# Altium project LimeSDR-X3_1v2.PrjPcb (part 2 of 20)

## Sheet 08_LMS1_RF.SchDoc: LMS7002M RF (LMS1)
size A3; Organization: Lime Microsystems; Address1: Surrey Tech Centre; Address2: Guildford GU2 7YG; Address3: Surrey; Address4: United Kingdom; Revision: 1.2; SheetNumber: 8; SheetTotal: 31
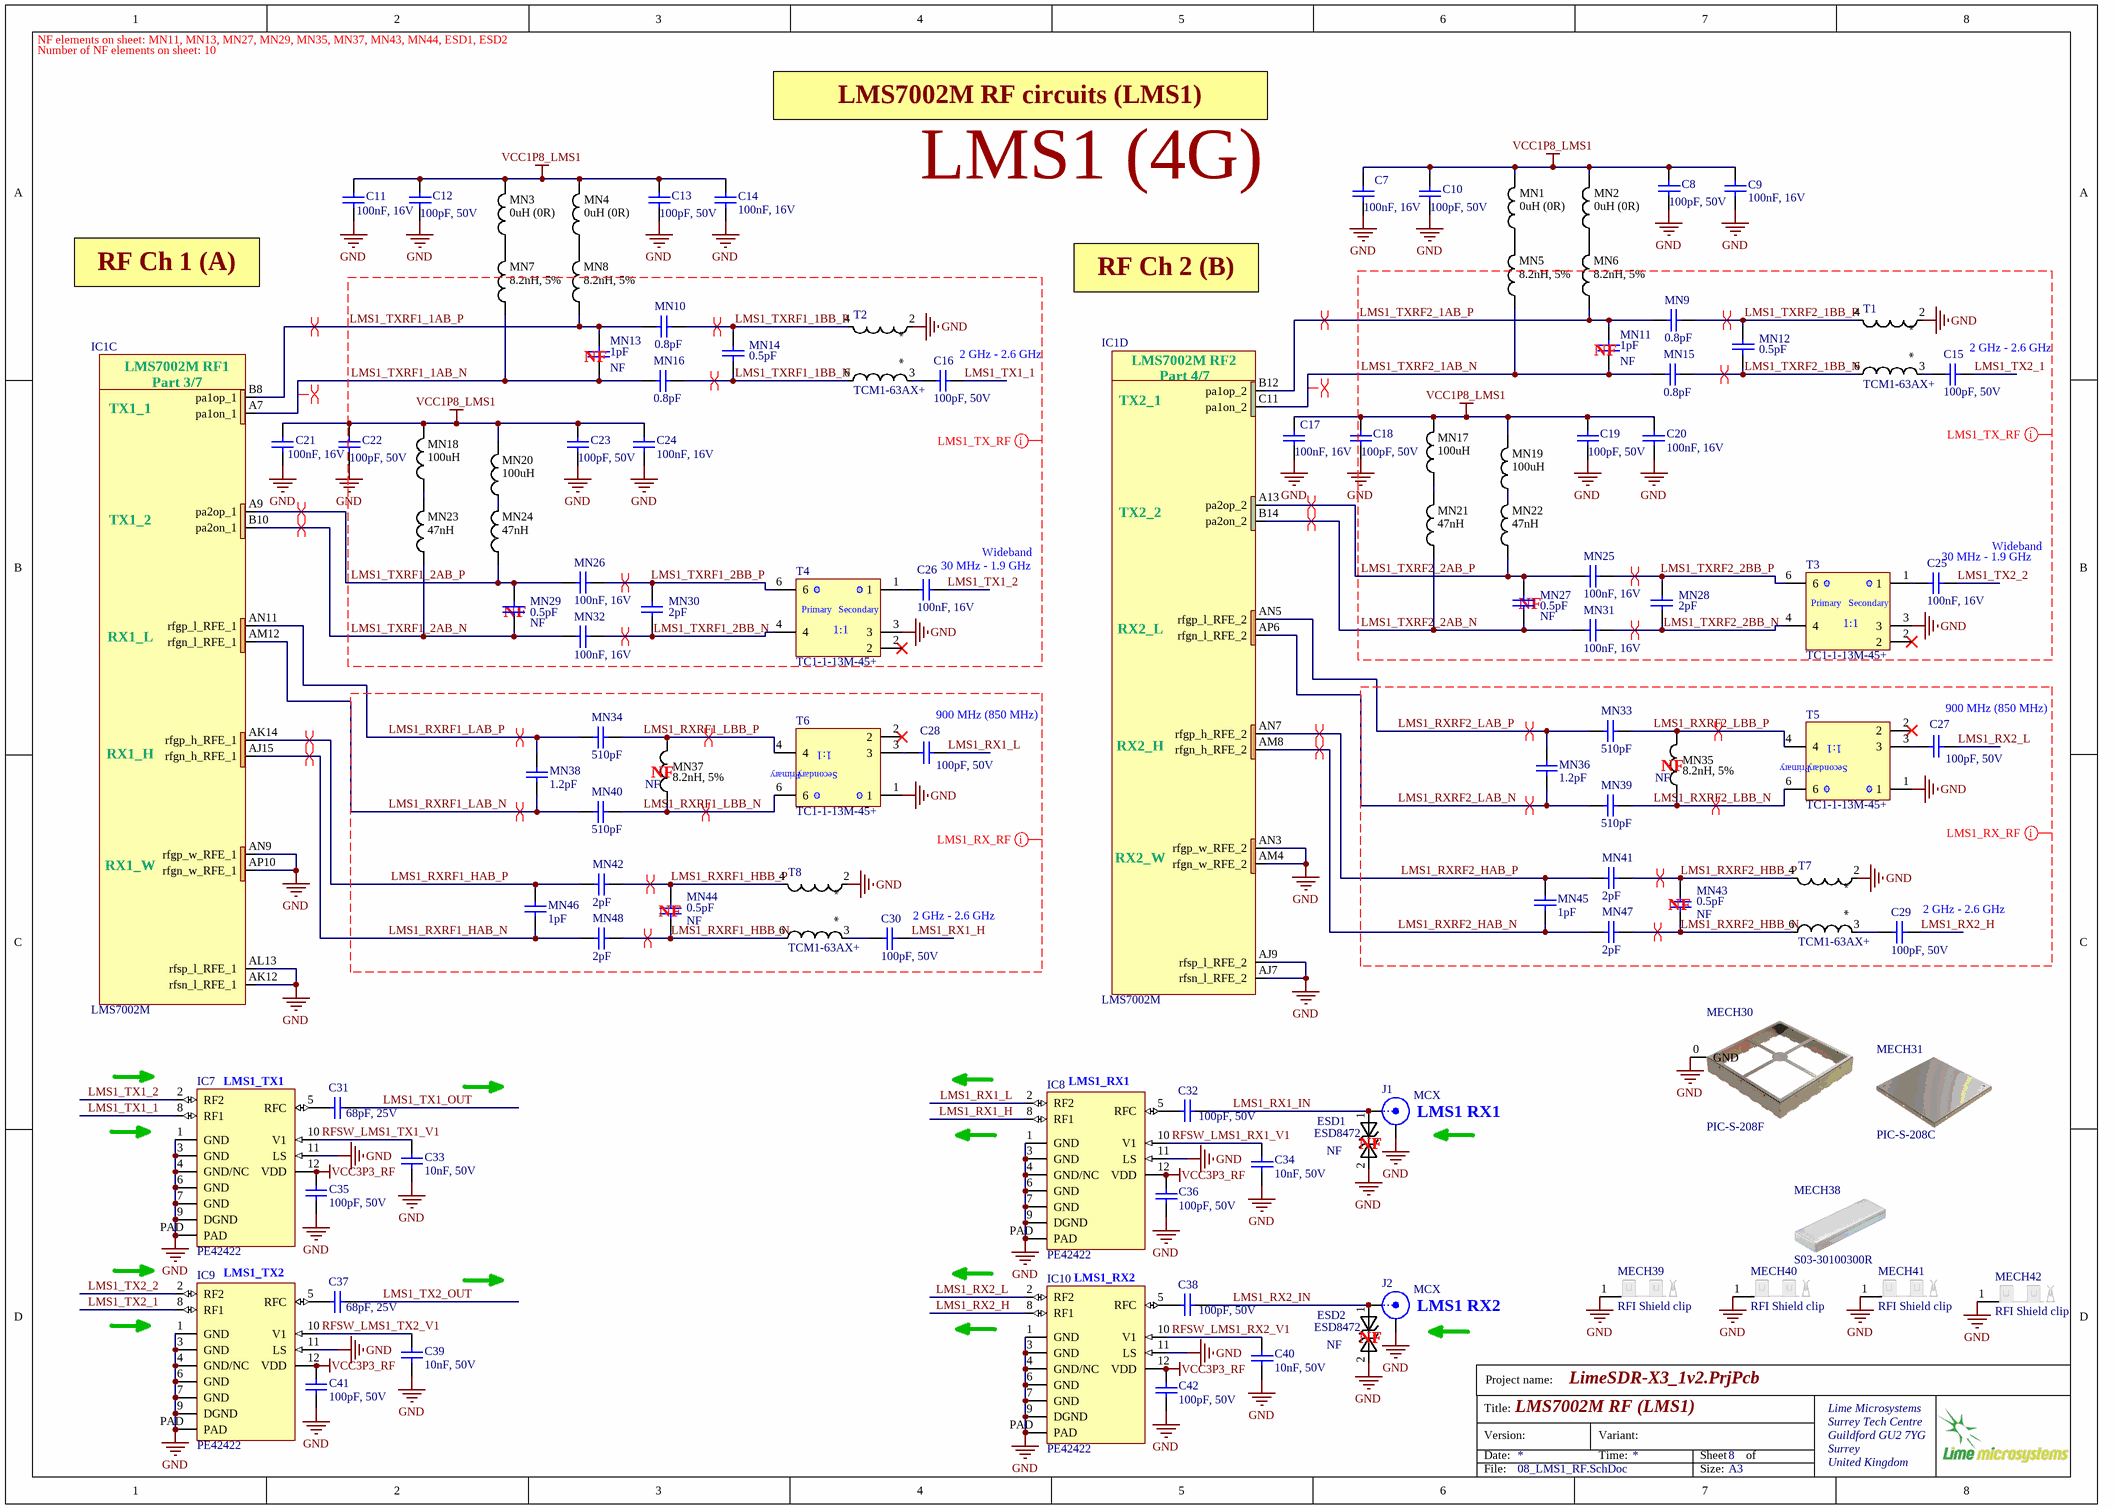
[diagram p7: 08_LMS1_RF.SchDoc]

### Parts
C7  100nF, 16V  [CAP0402]
C8  100pF, 50V  [CAP0402]
C9  100nF, 16V  [CAP0402]
C10  100pF, 50V  [CAP0402]
C11  100nF, 16V  [CAP0402]
C12  100pF, 50V  [CAP0402]
C13  100pF, 50V  [CAP0402]
C14  100nF, 16V  [CAP0402]
C15  100pF, 50V  [CAP0402]
C16  100pF, 50V  [CAP0402]
C17  100nF, 16V  [CAP0402]
C18  100pF, 50V  [CAP0402]
C19  100pF, 50V  [CAP0402]
C20  100nF, 16V  [CAP0402]
C21  100nF, 16V  [CAP0402]
C22  100pF, 50V  [CAP0402]
C23  100pF, 50V  [CAP0402]
C24  100nF, 16V  [CAP0402]
C25  100nF, 16V  [CAP0402]
C26  100nF, 16V  [CAP0402]
C27  100pF, 50V  [CAP0402]
C28  100pF, 50V  [CAP0402]
C29  100pF, 50V  [CAP0402]
C30  100pF, 50V  [CAP0402]
C31  68pF, 25V  [CAP0402]
C32  100pF, 50V  [CAP0402]
C33  10nF, 50V  [CAP0402]
C34  10nF, 50V  [CAP0402]
C35  100pF, 50V  [CAP0402]
C36  100pF, 50V  [CAP0402]
C37  68pF, 25V  [CAP0402]
C38  100pF, 50V  [CAP0402]
C39  10nF, 50V  [CAP0402]
C40  10nF, 50V  [CAP0402]
C41  100pF, 50V  [CAP0402]
C42  100pF, 50V  [CAP0402]
ESD1  ESD8472  Assembly Info: NF  [ESD8472_X3DFN2]
ESD2  ESD8472  Assembly Info: NF  [ESD8472_X3DFN2]
IC1  LMS7002M  [LMS7002M_v5]  (parts C,D of 7)
IC7  PE42422  [PE42422_QFN12]
IC8  PE42422  [PE42422_QFN12]
IC9  PE42422  [PE42422_QFN12]
IC10  PE42422  [PE42422_QFN12]
J1  MCX  [MCX_connector_vertical_SM]
J2  MCX  [MCX_connector_vertical_SM]
MECH30  PIC-S-208F  [PIC-S-208F_RF_SHIELD_FRAME_r0]
MECH31  PIC-S-208C  [PIC-S-208C_RF_SHIELD_COVER]
MECH38  S03-30100300R  [S03-30100300R_RF_SHIELD]
MECH39  RFI Shield clip  [RFI_SHIELD_CLPS_MINI]
MECH40  RFI Shield clip  [RFI_SHIELD_CLPS_MINI]
MECH41  RFI Shield clip  [RFI_SHIELD_CLPS_MINI]
MECH42  RFI Shield clip  [RFI_SHIELD_CLPS_MINI]
MN1  0uH (0R)  [RES0603]
MN2  0uH (0R)  [RES0603]
MN3  0uH (0R)  [RES0603]
MN4  0uH (0R)  [RES0603]
MN5  8.2nH, 5%  [RES0402]
MN6  8.2nH, 5%  [RES0402]
MN7  8.2nH, 5%  [RES0402]
MN8  8.2nH, 5%  [RES0402]
MN9  0.8pF  [CAP0402]
MN10  0.8pF  [CAP0402]
MN11  1pF  Assembly Info: NF  [CAP0402]
MN12  0.5pF  [CAP0402]
MN13  1pF  Assembly Info: NF  [CAP0402]
MN14  0.5pF  [CAP0402]
MN15  0.8pF  [CAP0402]
MN16  0.8pF  [CAP0402]
MN17  100uH  [RES0603]
MN18  100uH  [RES0603]
MN19  100uH  [RES0603]
MN20  100uH  [RES0603]
MN21  47nH  [RES0402]
MN22  47nH  [RES0402]
MN23  47nH  [RES0402]
MN24  47nH  [RES0402]
MN25  100nF, 16V  [CAP0402]
MN26  100nF, 16V  [CAP0402]
MN27  0.5pF  Assembly Info: NF  [CAP0402]
MN28  2pF  [CAP0402]
MN29  0.5pF  Assembly Info: NF  [CAP0402]
MN30  2pF  [CAP0402]
MN31  100nF, 16V  [CAP0402]
MN32  100nF, 16V  [CAP0402]
MN33  510pF  [CAP0402]
MN34  510pF  [CAP0402]
MN35  8.2nH, 5%  Assembly Info: NF  [RES0402]
MN36  1.2pF  [CAP0402]
MN37  8.2nH, 5%  Assembly Info: NF  [RES0402]
MN38  1.2pF  [CAP0402]
MN39  510pF  [CAP0402]
MN40  510pF  [CAP0402]
MN41  2pF  [CAP0402]
MN42  2pF  [CAP0402]
MN43  0.5pF  Assembly Info: NF  [CAP0402]
MN44  0.5pF  Assembly Info: NF  [CAP0402]
MN45  1pF  [CAP0402]
MN46  1pF  [CAP0402]
MN47  2pF  [CAP0402]
MN48  2pF  [CAP0402]
T1  TCM1-63AX+  [TCM1-63AX+_v2]
T2  TCM1-63AX+  [TCM1-63AX+_v2]
T3  TC1-1-13M-45+  [TC1-1-13MA+_JA4220-AL_]
T4  TC1-1-13M-45+  [TC1-1-13MA+_JA4220-AL_]
T5  TC1-1-13M-45+  [TC1-1-13MA+_JA4220-AL_]
T6  TC1-1-13M-45+  [TC1-1-13MA+_JA4220-AL_]
T7  TCM1-63AX+  [TCM1-63AX+_v2]
T8  TCM1-63AX+  [TCM1-63AX+_v2]

### Nets
GND: C7.1 C8.1 C9.1 C10.1 C11.1 C12.1 C13.1 C14.1 C17.1 C18.1 C19.1 C20.1 C21.1 C22.1 C23.1 C24.1 C33.2 C34.2 C35.1 C36.1 C39.2 C40.2 C41.1 C42.1 ESD1.2 ESD2.2 IC1.AJ7(rfsn_l_RFE_2) IC1.AJ9(rfsp_l_RFE_2) IC1.AK12(rfsn_l_RFE_1) IC1.AL13(rfsp_l_RFE_1) IC1.AM4(rfgn_w_RFE_2) IC1.AN3(rfgp_w_RFE_2) IC1.AN9(rfgp_w_RFE_1) IC1.AP10(rfgn_w_RFE_1) IC7.1(GND) IC7.3(GND) IC7.4(GND/NC) IC7.6(GND) IC7.7(GND) IC7.9(DGND) IC7.11(LS) IC7.PAD IC8.1(GND) IC8.3(GND) IC8.4(GND/NC) IC8.6(GND) IC8.7(GND) IC8.9(DGND) IC8.11(LS) IC8.PAD IC9.1(GND) IC9.3(GND) IC9.4(GND/NC) IC9.6(GND) IC9.7(GND) IC9.9(DGND) IC9.11(LS) IC9.PAD IC10.1(GND) IC10.3(GND) IC10.4(GND/NC) IC10.6(GND) IC10.7(GND) IC10.9(DGND) IC10.11(LS) IC10.PAD J1.2(Y) J2.2(Y) MECH30.0(GND) MECH39.1(GND) MECH40.1(GND) MECH41.1(GND) MECH42.1(GND) T1.2 T2.2 T3.3 T4.3 T5.1 T6.1 T7.2 T8.2
VCC1P8_LMS1: C7.2 C8.2 C9.2 C10.2 C11.2 C12.2 C13.2 C14.2 C17.2 C18.2 C19.2 C20.2 C21.2 C22.2 C23.2 C24.2 MN1.2 MN2.2 MN3.2 MN4.2 MN17.2 MN18.2 MN19.2 MN20.2
VCC3P3_RF: C35.2 C36.2 C41.2 C42.2 IC7.12(VDD) IC8.12(VDD) IC9.12(VDD) IC10.12(VDD)
LMS1_RX1_H: C30.1 IC8.8(RF1)
LMS1_RX1_IN: C32.1 ESD1.1 J1.1(X)
LMS1_RX1_L: C28.1 IC8.2(RF2)
LMS1_RX2_H: C29.1 IC10.8(RF1)
LMS1_RX2_IN: C38.1 ESD2.1 J2.1(X)
LMS1_RX2_L: C27.1 IC10.2(RF2)
LMS1_RXRF1_HAB_N: IC1.AJ15(rfgn_h_RFE_1) MN46.1 MN48.2
LMS1_RXRF1_HAB_P: IC1.AK14(rfgp_h_RFE_1) MN42.2 MN46.2
LMS1_RXRF1_HBB_N: MN44.1 MN48.1 T8.6
LMS1_RXRF1_HBB_P: MN42.1 MN44.2 T8.4
LMS1_RXRF1_LAB_N: IC1.AM12(rfgn_l_RFE_1) MN38.1 MN40.2
LMS1_RXRF1_LAB_P: IC1.AN11(rfgp_l_RFE_1) MN34.2 MN38.2
LMS1_RXRF1_LBB_N: MN37.1 MN40.1 T6.6
LMS1_RXRF1_LBB_P: MN34.1 MN37.2 T6.4
LMS1_RXRF2_HAB_N: IC1.AM8(rfgn_h_RFE_2) MN45.1 MN47.2
LMS1_RXRF2_HAB_P: IC1.AN7(rfgp_h_RFE_2) MN41.2 MN45.2
LMS1_RXRF2_HBB_N: MN43.1 MN47.1 T7.6
LMS1_RXRF2_HBB_P: MN41.1 MN43.2 T7.4
LMS1_RXRF2_LAB_N: IC1.AP6(rfgn_l_RFE_2) MN36.1 MN39.2
LMS1_RXRF2_LAB_P: IC1.AN5(rfgp_l_RFE_2) MN33.2 MN36.2
LMS1_RXRF2_LBB_N: MN35.1 MN39.1 T5.6
LMS1_RXRF2_LBB_P: MN33.1 MN35.2 T5.4
LMS1_TX1_1: C16.1 IC7.8(RF1)
LMS1_TX1_2: C26.1 IC7.2(RF2)
LMS1_TX1_OUT: C31.2
LMS1_TX2_1: C15.1 IC9.8(RF1)
LMS1_TX2_2: C25.1 IC9.2(RF2)
LMS1_TX2_OUT: C37.2
LMS1_TXRF1_1AB_N: IC1.A7(pa1on_1) MN7.1 MN13.2 MN16.2
LMS1_TXRF1_1AB_P: IC1.B8(pa1op_1) MN8.1 MN10.2 MN13.1
LMS1_TXRF1_1BB_N: MN14.1 MN16.1 T2.6
LMS1_TXRF1_1BB_P: MN10.1 MN14.2 T2.4
LMS1_TXRF1_2AB_N: IC1.B10(pa2on_1) MN23.1 MN29.1 MN32.1
LMS1_TXRF1_2AB_P: IC1.A9(pa2op_1) MN24.1 MN26.2 MN29.2
LMS1_TXRF1_2BB_N: MN30.1 MN32.2 T4.4
LMS1_TXRF1_2BB_P: MN26.1 MN30.2 T4.6
LMS1_TXRF2_1AB_N: IC1.C11(pa1on_2) MN5.1 MN11.2 MN15.2
LMS1_TXRF2_1AB_P: IC1.B12(pa1op_2) MN6.1 MN9.2 MN11.1
LMS1_TXRF2_1BB_N: MN12.1 MN15.1 T1.6
LMS1_TXRF2_1BB_P: MN9.1 MN12.2 T1.4
LMS1_TXRF2_2AB_N: IC1.B14(pa2on_2) MN21.1 MN27.1 MN31.1
LMS1_TXRF2_2AB_P: IC1.A13(pa2op_2) MN22.1 MN25.2 MN27.2
LMS1_TXRF2_2BB_N: MN28.1 MN31.2 T3.4
LMS1_TXRF2_2BB_P: MN25.1 MN28.2 T3.6
RFSW_LMS1_RX1_V1: C34.1 IC8.10(V1)
RFSW_LMS1_RX2_V1: C40.1 IC10.10(V1)
RFSW_LMS1_TX1_V1: C33.1 IC7.10(V1)
RFSW_LMS1_TX2_V1: C39.1 IC9.10(V1)
NetC15_2: C15.2 T1.3
NetC16_2: C16.2 T2.3
NetC25_2: C25.2 T3.1
NetC26_2: C26.2 T4.1
NetC27_2: C27.2 T5.3
NetC28_2: C28.2 T6.3
NetC29_2: C29.2 T7.3
NetC30_2: C30.2 T8.3
NetC31_1: C31.1 IC7.5(RFC)
NetC32_2: C32.2 IC8.5(RFC)
NetC37_1: C37.1 IC9.5(RFC)
NetC38_2: C38.2 IC10.5(RFC)
NetMN1_1: MN1.1 MN5.2
NetMN2_1: MN2.1 MN6.2
NetMN3_1: MN3.1 MN7.2
NetMN4_1: MN4.1 MN8.2
NetMN17_1: MN17.1 MN21.2
NetMN18_1: MN18.1 MN23.2
NetMN19_1: MN19.1 MN22.2
NetMN20_1: MN20.1 MN24.2

Not connected (* = marked no-connect by the designer): T3 2*; T4 2*; T5 2*; T6 2*

### Layout directives
differential pair: LMS1_RXRF1_HAB_N, LMS1_RXRF1_HAB_P, LMS1_RXRF1_HBB_N, LMS1_RXRF1_HBB_P, LMS1_RXRF1_LAB_N, LMS1_RXRF1_LAB_P, LMS1_RXRF1_LBB_N, LMS1_RXRF1_LBB_P, LMS1_RXRF2_HAB_N, LMS1_RXRF2_HAB_P, LMS1_RXRF2_HBB_N, LMS1_RXRF2_HBB_P, LMS1_RXRF2_LAB_N, LMS1_RXRF2_LAB_P, LMS1_RXRF2_LBB_N, LMS1_RXRF2_LBB_P, LMS1_TXRF1_1AB_N, LMS1_TXRF1_1AB_P, LMS1_TXRF1_1BB_N, LMS1_TXRF1_1BB_P, LMS1_TXRF1_2AB_N, LMS1_TXRF1_2AB_P, LMS1_TXRF1_2BB_N, LMS1_TXRF1_2BB_P, LMS1_TXRF2_1AB_N, LMS1_TXRF2_1AB_P, LMS1_TXRF2_1BB_N, LMS1_TXRF2_1BB_P, LMS1_TXRF2_2AB_N, LMS1_TXRF2_2AB_P, LMS1_TXRF2_2BB_N, LMS1_TXRF2_2BB_P
net class LMS1_TX_RF: GND, LMS1_TX1_1, LMS1_TX1_2, LMS1_TX2_1, LMS1_TX2_2, LMS1_TXRF1_1AB_N, LMS1_TXRF1_1AB_P, LMS1_TXRF1_1BB_N, LMS1_TXRF1_1BB_P, LMS1_TXRF1_2AB_N, LMS1_TXRF1_2AB_P, LMS1_TXRF1_2BB_N, LMS1_TXRF1_2BB_P, LMS1_TXRF2_1AB_N, LMS1_TXRF2_1AB_P, LMS1_TXRF2_1BB_N, LMS1_TXRF2_1BB_P, LMS1_TXRF2_2AB_N, LMS1_TXRF2_2AB_P, LMS1_TXRF2_2BB_N, LMS1_TXRF2_2BB_P, VCC1P8_LMS1
net class LMS1_RX_RF: GND, LMS1_RX1_H, LMS1_RX1_L, LMS1_RX2_H, LMS1_RX2_L, LMS1_RXRF1_HAB_N, LMS1_RXRF1_HAB_P, LMS1_RXRF1_HBB_N, LMS1_RXRF1_HBB_P, LMS1_RXRF1_LAB_N, LMS1_RXRF1_LAB_P, LMS1_RXRF1_LBB_N, LMS1_RXRF1_LBB_P, LMS1_RXRF2_HAB_N, LMS1_RXRF2_HAB_P, LMS1_RXRF2_HBB_N, LMS1_RXRF2_HBB_P, LMS1_RXRF2_LAB_N, LMS1_RXRF2_LAB_P, LMS1_RXRF2_LBB_N, LMS1_RXRF2_LBB_P

### Notes on the sheet
- NF elements on sheet: MN11, MN13, MN27, MN29, MN35, MN37, MN43, MN44, ESD1, ESD2
- Number of NF elements on sheet: 10
- LMS7002M RF circuits (LMS1)
- LMS1 (4G)
- RF Ch 1 (A)
- RF Ch 2 (B)
- (near MN13) NF
- (near C16) 2 GHz - 2.6 GHz
- (near MN11) NF
- (near C15) 2 GHz - 2.6 GHz
- (near C26) 30 MHz - 1.9 GHz
- Wideband
- (near C25) 30 MHz - 1.9 GHz
- (near MN29) NF
- (near MN27) NF
- (near C28) 900 MHz (850 MHz)
- (near C27) 900 MHz (850 MHz)
- (near MN37) NF
- (near MN35) NF
- (near MN44) NF
- (near C30) 2 GHz - 2.6 GHz
- (near MN43) NF
- (near C29) 2 GHz - 2.6 GHz
- (near IC7) LMS1_TX1
- (near IC8) LMS1_RX1
- (near J1) LMS1 RX1
- (near ESD1) NF
- (near IC9) LMS1_TX2
- (near IC10) LMS1_RX2
- (near J2) LMS1 RX2
- (near ESD2) NF
- Project name:
- Title:
- Version:
- Date:
- Variant:
- Time:
- Sheet
- of
- File:
- Size:
- A3
- (in symbol LMS7002Mr4, part C) LMS7002M RF1; Part 3/7; TX1_1; TX1_2; RX1_L; RX1_H; RX1_W
- (in symbol LMS7002Mr4, part D) LMS7002M RF2; Part 4/7; TX2_1; TX2_2; RX2_L; RX2_H; RX2_W
- (in symbol TC1-1-13M+) 1:1; Primary; Secondary

### Library data of the parts
C7 C9 C11 C14 C17 C20 C21 C24-C26 = Cap_0402: Manufacturer: Murata Electronics; Manufacturer Part Number 1: GRM155R71C104KA88D; Part Description: 0.10µF ±10% 16V X7R Ceramic Capacitor -55°C ~ 125°C Surface Mount, MLCC 0402 (1005 Metric) 0.039" L x 0.020" W (1.00mm x 0.50mm); Tolerance: 10 %; Type: General Purpose MLCC; Capacitance: 0.1 uF; Case Length: 1 mm; Dielectric: X7R; Case Height: 0.5 mm; Temperature Coefficient / Code: +/- 15 %; Value: 100nF, 16V; Supplier 1: Mouser; Supplier Part Number 1: 81-GRM155R71C104KA88; Case Code - in: 0402; RoHS: RoHS Compliant; Operating Temperature Range: - 55 C to + 125 C; Series: GRM; Termination Style: SMD/SMT; Package / Case: 0402 (1005 metric); Voltage Rating DC: 16 V; Maximum Operating Temperature: + 125 C; Case Code - mm: 1005; Minimum Operating Temperature: - 55 C; Product Category: Low & Medium Capacitance SMD Ceramic Chip Capacitors; Packaging: Reel; Product: General Type MLCCs; Category: Multilayer Ceramic Capacitors MLCC - SMD/SMT; Brand: Murata Electronics; Case Width: 0.5 mm; RoHS - Mouser: Y; Standard Pack Qty: 10000; Minimum Order Quantity: 1; Reeling: True
C8 C10 C12 C13 C18 C19 C22 C23 = Cap_0402: Manufacturer Part Number 1: CC0402JRNPO9BN101; Manufacturer: Yageo; Part Description: 100pF ±5% 50V C0G, NP0 Ceramic Capacitor -55°C ~ 125°C Surface Mount, MLCC 0402 (1005 Metric) 0.039" L x 0.020" W (1.00mm x 0.50mm); Temperature Coefficient: C0G, NP0; Tolerance: ±5%; Value: 100pF, 50V; Supplier 1: Digi-Key; Supplier Part Number 1: 311-1024-1-ND; RoHS: RoHS Compliant; Category: Capacitors; Applications: General Purpose; Mounting Type: Surface Mount, MLCC; Capacitance: 100pF; Ratings: -; Packaging: Cut Tape (CT); Voltage - Rated: 50V; Size / Dimension: 0.039" L x 0.020" W (1.00mm x 0.50mm); Height - Seated (Max): -; Package / Case: 0402 (1005 Metric); Operating Temperature: -55°C ~ 125°C; Features: -; Lead Spacing: -; Lead Style: -; Thickness (Max): 0.022" (0.55mm)
C15 C16 C27-C30 C32 C35 C36 C38 C41 C42 = Cap_0402: Manufacturer Part Number 1: CC0402JRNPO9BN101; Manufacturer: Yageo; Part Description: 100pF ±5% 50V C0G, NP0 Ceramic Capacitor -55°C ~ 125°C Surface Mount, MLCC 0402 (1005 Metric) 0.039" L x 0.020" W (1.00mm x 0.50mm); Tolerance: ±5%; Temperature Coefficient: C0G, NP0; Value: 100pF, 50V; Capacitance: 100pF; Thickness (Max): 0.022" (0.55mm); Size / Dimension: 0.039" L x 0.020" W (1.00mm x 0.50mm); RoHS: RoHS Compliant; Ratings: -; Package / Case: 0402 (1005 Metric); Mounting Type: Surface Mount, MLCC; Height - Seated (Max): -; Features: -; Lead Spacing: -; Voltage - Rated: 50V; Operating Temperature: -55°C ~ 125°C; Packaging: Cut Tape (CT); Applications: General Purpose; Lead Style: -; Supplier 1: Digi-Key; Category: Capacitors; Supplier Part Number 1: 311-1024-1-ND
C31 C37 = Cap_0402: Manufacturer Part Number 1: CBR04C680F3GAC; Manufacturer: Kemet; Part Description: 68pF ±1% 25V Ceramic Capacitor C0G, NP0 0402 (1005 Metric); Temperature Coefficient: C0G, NP0; Tolerance: ±1%; Value: 68pF, 25V; Supplier 1: Digi-Key; Supplier Part Number 1: 399-11255-1-ND; Applications: RF, Microwave, High Frequency; Voltage - Rated: 25V; Capacitance: 68pF; Mounting Type: Surface Mount, MLCC; Package / Case: 0402 (1005 Metric); Features: High Q, Low Loss; Lead Spacing: -; Size / Dimension: 0.039" L x 0.020" W (1.00mm x 0.50mm); Operating Temperature: -55°C ~ 125°C; Packaging: Cut Tape (CT); Thickness (Max): 0.022" (0.55mm); Category: Capacitors; Lead Style: -; Ratings: -; Height - Seated (Max): -; RoHS: RoHS Compliant
C33 C34 C39 C40 = Cap_0402: Part Description: 10000pF ±10% 50V Ceramic Capacitor X7R 0402 (1005 Metric); Manufacturer: Murata Electronics North America; Manufacturer Part Number 1: GRM155R71H103KA88D; Tolerance: ±10%; Temperature Coefficient: X7R; Value: 10nF, 50V; Supplier 1: Digi-Key; Supplier Part Number 1: 490-4516-2-ND; RoHS: RoHS Compliant; Category: Capacitors; Stock 1: 10970000; Pricing 1: 10000=0.00185, 20000=0.00176, 30000=0.00167 (USD); Packaging: Tape & Reel (TR); Part Status: Active; Voltage - Rated: 50V; Operating Temperature: -55°C ~ 125°C; Features: -; Ratings: -; Applications: General Purpose; Mounting Type: Surface Mount, MLCC; Package / Case: 0402 (1005 Metric); Size / Dimension: 0.039" L x 0.020" W (1.00mm x 0.50mm); Height - Seated (Max): -; Thickness (Max): 0.022" (0.55mm); Lead Spacing: -; Lead Style: -; ComponentLink1URL: http://www.murata.com/~/media/webrenewal/support/library/catalog/products/capacitor/mlcc/c02e.ashx?la=en-us; ComponentLink1Description: http://www.murata.com/~/media/webrenewal/support/library/catalog/products/capacitor/mlcc/c02e.ashx?la=en-us
ESD1 ESD2 = ESD8472: Manufacturer: ON Semiconductor; Manufacturer Part Number 1: ESD8472MUT5G; Part Description: TVS DIODE 5.3VWM 14VC X3DFN2; Voltage - Reverse Standoff (Typ): 5.3V (Max); Voltage - Breakdown (Min): 7V; Voltage - Clamping (Max) @ Ipp: 14V; Current - Peak Pulse (10/1000µs): 3A (8/20µs); Power Line Protection: No; Capacitance @ Frequency: 0.2pF @ 1MHz; Supplier 1: Digi-Key; RoHS: RoHS Compliant; Category: Circuit Protection; Stock 1: 2295; Pricing 1: 1=0.39, 10=0.315, 100=0.2142, 500=0.16068, 1000=0.12051 (USD); Packaging: Cut Tape (CT); Part Status: Active; Type: Zener; Power - Peak Pulse: -; Applications: Automotive, RF Antenna; Operating Temperature: -55°C ~ 150°C (TJ); Mounting Type: Surface Mount; Package / Case: 2-XFDFN; Supplier Device Package: 2-X3DFN (0.62x0.32); ComponentLink1URL: http://www.onsemi.com/pub/Collateral/ESD8472-D.PDF; ComponentLink1Description: http://www.onsemi.com/pub/Collateral/ESD8472-D.PDF; Supplier Part Number 1: ESD8472MUT5GOSCT-ND
IC1 = LMS7002Mr4: as IC1 on sheet 05_LMS1_Misc; Supplier 1: Lime Microsystems; Supplier Part Number 1: LMS7002M; Manufacturer Part Number 1: LMS7002M
IC7-IC10 = PE42422: Manufacturer: Peregrine Semiconductor; Manufacturer Part Number 1: PE42422MLAA-Z; Part Description: IC RF SWITCH SPDT 50 OHM 12QFN; Frequency - Lower: 100MHz; Isolation @ Frequency: 17dB @ 6GHz (typ); Insertion Loss @ Frequency: 0.9dB @ 6GHz; IIP3: 70dBm (typ); Topology: Reflective; Circuit: SPDT; Impedance: 50 Ohm; Voltage - Supply: 2.3 V ~ 5.5 V; RF Type: General Purpose; Supplier 1: Digi-Key; RoHS: RoHS Compliant; Category: RF/IF and RFID; Stock 1: 21993; Pricing 1: 1=1.32, 101=0.92 (USD); Packaging: Cut Tape (CT); Part Status: Active; P1dB: -; Features: -; Operating Temperature: -40°C ~ 85°C; Package / Case: 12-UFQFN Exposed Pad; Supplier Device Package: 12-QFN (2x2); ComponentLink1URL: http://www.psemi.com/pdf/datasheets/pe42422ds.pdf; ComponentLink1Description: http://www.psemi.com/pdf/datasheets/pe42422ds.pdf; Supplier Part Number 1: 1046-1062-1-ND
J1 J2 = RF_IF_connector: Part Description: MCX Connector Jack, Female Socket 50 Ohms Surface Mount Solder; Manufacturer: Bel Cinch; Manufacturer Part Number 1: 133-3711-201; ComponentLink1URL: https://datasheet.ciiva.com/5177/c908-22101t-37976-5177328.pdf?src-supplier=Mouser; ComponentLink1Description: https://datasheet.ciiva.com/5177/c908-22101t-37976-5177328.pdf?src-supplier=Mouser; ComponentLink2URL: https://datasheet.ciiva.com/643/c908-22101t-643558.pdf?src-supplier=Digi-Key; ComponentLink2Description: https://datasheet.ciiva.com/643/c908-22101t-643558.pdf?src-supplier=Digi-Key; ComponentLink3URL: https://datasheet.ciiva.com/7662/1636995-7662651.pdf?src-supplier=Element14; ComponentLink3Description: https://datasheet.ciiva.com/7662/1636995-7662651.pdf?src-supplier=Element14; ComponentLink4URL: https://datasheet.ciiva.com/5689/c908-22101t-5689787.pdf?src-supplier=Farnell; ComponentLink4Description: https://datasheet.ciiva.com/5689/c908-22101t-5689787.pdf?src-supplier=Farnell; ComponentLink5URL: https://datasheet.ciiva.com/7996/691284-7996807.pdf?src-supplier=Element14; ComponentLink5Description: https://datasheet.ciiva.com/7996/691284-7996807.pdf?src-supplier=Element14; ComponentLink6URL: https://datasheet.ciiva.com/643/c908-22101t-643559.pdf?src-supplier=Digi-Key; ComponentLink6Description: https://datasheet.ciiva.com/643/c908-22101t-643559.pdf?src-supplier=Digi-Key; ComponentLink7URL: https://datasheet.ciiva.com/643/c908-22101t-643560.pdf?src-supplier=Digi-Key; ComponentLink7Description: https://datasheet.ciiva.com/643/c908-22101t-643560.pdf?src-supplier=Digi-Key; Supplier 1: Digikey; Supplier Part Number 1: J548-ND; Stock 1: 6208; Pricing 1: 1=2,86, 10=2,595, 25=2,4576, 50=2,4006, 100=2,2862, 250=2,01248 (USD); RoHS: Yes; Housing Material: 152ConductorMaterial; ComponentLink8URL: https://datasheet.ciiva.com/643/dr-1333711201-643313.pdf?src-supplier=Digikey; ComponentLink8Description: https://datasheet.ciiva.com/643/dr-1333711201-643313.pdf?src-supplier=Digikey; ComponentLink9URL: https://datasheet.ciiva.com/3131/pi-133-3711-201-3131233.pdf?src-supplier=Avnet; ComponentLink9Description: https://datasheet.ciiva.com/3131/pi-133-3711-201-3131233.pdf?src-supplier=Avnet; ComponentLink10URL: https://datasheet.ciiva.com/23817/1720439-23817678.pdf?src-supplier=Newark; ComponentLink10Description: https://datasheet.ciiva.com/23817/1720439-23817678.pdf?src-supplier=Newark; ComponentLink11URL: https://datasheet.ciiva.com/23769/249599-23769434.pdf?src-supplier=Newark; ComponentLink11Description: https://datasheet.ciiva.com/23769/249599-23769434.pdf?src-supplier=Newark; ComponentLink12URL: https://datasheet.ciiva.com/22686/1720437-22686743.pdf?src-supplier=Element14; ComponentLink12Description: https://datasheet.ciiva.com/22686/1720437-22686743.pdf?src-supplier=Element14
MECH30 = PIC-S-208F_RF_SHIELD_FRAME: Part Description: RF Shield Frame 1.559" (39.60mm) X 1.559" (39.60mm) Solder; Manufacturer: 3G Shielding Specialties LP; Manufacturer Part Number 1: PIC-S-208F; Supplier Part Number 1: 2276-PIC-S-208FTR-ND; Supplier 1: Digi-Key
MECH31 = PIC-S-208C_RF_SHIELD_COVER: Part Description: RF Shield Cover 1.559" (39.60mm) X 1.559" (39.60mm) Vent Holes in Pattern Snap Fit; Manufacturer: 3G Shielding Specialties LP; Manufacturer Part Number 1: PIC-S-208C; Supplier Part Number 1: 2276-PIC-S-208C-ND; Supplier 1: Digi-Key
MECH38 = S03-30100300R_RF_SHIELD: Part Description: RF Shield CAN 0.394" (10.00mm) X 1.181" (30.00mm) Non-Vented Surface Mount; Manufacturer: Harwin; Supplier 1: Digikey; Supplier Part Number 1: 952-S03-30100300RCT-ND; Manufacturer Part Number 1: S03-30100300R; Stock 1: 1392; Pricing 1: 1=2,15, 10=1,344, 25=1,1328, 100=0,8933, 250=0,77572 (USD); RoHS: No; Mount: Surface Mount; Series: EZ BoardWare
MECH39-MECH42 = RFI_SHIELD_CLIP: Manufacturer Part Number 1: S0971-46R; Manufacturer: HARWIN; Part Description: RFI SHIELD CLIP MINI TIN SMD; SVHC: No SVHC (15-Jun-2015); Supplier 1: Farnell; Supplier: Farnell; Length: 5.8; Clip Type: RFI Shield Clip; Clip Diameter: -; Product Range: -; Mounting Hole Dia: -; RoHS: YES; Supplier Part Number 1: 2361677
MN1 MN3 = Inductor_0603: Part Description: 0 Ohms Jumper 0.1W, 1/10W Chip Resistor 0603 (1608 Metric) Automotive AEC-Q200 Thick Film; Manufacturer: Panasonic Electronic Components; Manufacturer Part Number: ERJ-3GEY0R00V; Tolerance: Jumper; Power (Watts): 0.1W, 1/10W; Value: 0uH (0R); Supplier 1: Digi-Key; Supplier Part Number 1: P0.0GCT-ND; RoHS: RoHS Compliant; Category: Resistors; Stock 1: 31663129; Pricing 1: 1=0.1, 10=0.04, 25=0.0292, 50=0.0222, 100=0.0164, 250=0.01252, 500=0.01002, 1000=0.00737 (USD); Packaging: Cut Tape (CT); Part Status: Active; Composition: Thick Film; Features: Automotive AEC-Q200; Temperature Coefficient: -; Operating Temperature: -55°C ~ 155°C; Package / Case: 0603 (1608 Metric); Supplier Device Package: 0603; Size / Dimension: 0.063" L x 0.032" W (1.60mm x 0.80mm); Height - Seated (Max): 0.022" (0.55mm); Failure Rate: -; ComponentLink1URL: http://industrial.panasonic.com/www-cgi/jvcr13pz.cgi?E+PZ+3+AOA0001+ERJ3GEY0R00V+7+WW; ComponentLink1Description: http://industrial.panasonic.com/www-cgi/jvcr13pz.cgi?E+PZ+3+AOA0001+ERJ3GEY0R00V+7+WW; Manufacturer Part Number 1: ERJ-3GEY0R00V
MN2 MN4 = Inductor_0603: Part Description: 0 Ohms Jumper 0.1W, 1/10W Chip Resistor 0603 (1608 Metric) Automotive AEC-Q200 Thick Film; Manufacturer: Panasonic Electronic Components; Manufacturer Part Number: ERJ-3GEY0R00V; Power (Watts): 0.1W, 1/10W; Tolerance: Jumper; Value: 0uH (0R); Category: Resistors; ComponentLink1Description: http://industrial.panasonic.com/www-cgi/jvcr13pz.cgi?E+PZ+3+AOA0001+ERJ3GEY0R00V+7+WW; ComponentLink1URL: http://industrial.panasonic.com/www-cgi/jvcr13pz.cgi?E+PZ+3+AOA0001+ERJ3GEY0R00V+7+WW; Composition: Thick Film; Failure Rate: -; Features: Automotive AEC-Q200; Height - Seated (Max): 0.022" (0.55mm); Operating Temperature: -55°C ~ 155°C; Package / Case: 0603 (1608 Metric); Packaging: Cut Tape (CT); Part Status: Active; Pricing 1: 1=0.1, 10=0.04, 25=0.0292, 50=0.0222, 100=0.0164, 250=0.01252, 500=0.01002, 1000=0.00737 (USD); RoHS: RoHS Compliant; Size / Dimension: 0.063" L x 0.032" W (1.60mm x 0.80mm); Stock 1: 31663129; Supplier 1: Digi-Key; Supplier Device Package: 0603; Supplier Part Number 1: P0.0GCT-ND; Temperature Coefficient: -; Manufacturer Part Number 1: ERJ-3GEY0R00V
MN5-MN8 MN35 MN37 = Inductor_0603: Manufacturer: COILCRAFT; Manufacturer Part Number 1: 0402HP-8N2XJLU; Part Description: INDUCTOR, RF, 8.2NH, 5%, 5.4GHZ, SMD; Product Range:0402HP Series; Inductance:8.2nH; Inductance Tolerance:± 5%; High Frequency Inductor Case:0402 [1005 Metric]; Self Resonant Frequency Min:5.4GHz; DC Resistance Max:0.065ohm; DC Current Rating:1.5A; Inductor Construction: Wirewound; DC Current Rating: 1.5; Inductor Case Style: 0402 [1005 Metric]<!--FANDB--><div class="features-and-benefits-container"></div>; Self Resonant Frequency Min: 5.4; DC Resistance Max: 0.065; High Frequency Inductor Case: 0402 [1005 Metric]; SVHC: No SVHC (16-Jun-2014); Inductance: 8.2; Supplier 1: Farnell; Supplier Part Number 1: 2285826; Packaging: Cut Tape; Product Range: COILCRAFT - 0402; Inductance Tolerance: ± 5%; RoHS: Y-EX; Value: 8.2nH, 5%
MN9 MN10 MN15 MN16 = Cap_0402: Manufacturer: Murata Electronics North America; Manufacturer Part Number: GRM1555C1HR80BA01D; Part Description: 0.80pF ±0.1pF 50V C0G, NP0 Ceramic Capacitor -55°C ~ 125°C Surface Mount, MLCC 0402 (1005 Metric) 0.039" L x 0.020" W (1.00mm x 0.50mm); Temperature Coefficient: C0G, NP0; Capacitance: 0.80pF; Voltage - Rated: 50V; Tolerance: ±0.1pF; Value: 0.8pF; Applications: General Purpose; Operating Temperature: -55°C ~ 125°C; Size / Dimension: 0.039" L x 0.020" W (1.00mm x 0.50mm); Features: -; Supplier 1: Digi-Key; Height - Seated (Max): -; Category: Capacitors; Package / Case: 0402 (1005 Metric); Mounting Type: Surface Mount, MLCC; Lead Spacing: -; Thickness (Max): 0.022" (0.55mm); RoHS: RoHS Compliant; Supplier Part Number 1: 490-6269-1-ND; Packaging: Cut Tape (CT); Ratings: -; Lead Style: -; Manufacturer Part Number 1: GRM1555C1HR80BA01D
MN11 MN13 MN45 MN46 = Cap_0402: Manufacturer: TDK Corporation; Manufacturer Part Number 1: C1005C0G1H010B050BA; Part Description: 1pF ±0.1pF 50V C0G, NP0 Ceramic Capacitor -55°C ~ 125°C Surface Mount, MLCC 0402 (1005 Metric) 0.039" L x 0.020" W (1.00mm x 0.50mm); Voltage - Rated: 50V; Temperature Coefficient: C0G, NP0; Tolerance: ±0.1pF; Value: 1pF; Supplier 1: Digi-Key; Supplier Part Number 1: 445-4854-6-ND; Size / Dimension: 0.039" L x 0.020" W (1.00mm x 0.50mm); Lead Spacing: -; Operating Temperature: -55°C ~ 125°C; Thickness (Max): 0.022" (0.55mm); Package / Case: 0402 (1005 Metric); Features: -; Lead Style: -; Applications: General Purpose; Height - Seated (Max): -; Capacitance: 1pF; RoHS: RoHS Compliant; Mounting Type: Surface Mount, MLCC; Packaging: Digi-Reel®; Ratings: -; Category: Capacitors
MN12 MN14 MN27 MN29 MN43 MN44 = Cap_0402: Manufacturer: Yageo; Manufacturer Part Number 1: CC0402CRNPO9BNR50; Part Description: 0.50pF ±0.25pF 50V C0G, NP0 Ceramic Capacitor -55°C ~ 125°C Surface Mount, MLCC 0402 (1005 Metric) 0.039" L x 0.020" W (1.00mm x 0.50mm); Capacitance: 0.50pF; Voltage - Rated: 50V; Temperature Coefficient: C0G, NP0; Tolerance: ±0.25pF; Value: 0.5pF; Supplier 1: Digi-Key; Supplier Part Number 1: 311-1001-1-ND; RoHS: RoHS Compliant; Thickness (Max): 0.022" (0.55mm); Features: -; Height - Seated (Max): -; Lead Spacing: -; Applications: General Purpose; Packaging: Cut Tape (CT); Ratings: -; Size / Dimension: 0.039" L x 0.020" W (1.00mm x 0.50mm); Lead Style: -; Mounting Type: Surface Mount, MLCC; Operating Temperature: -55°C ~ 125°C; Package / Case: 0402 (1005 Metric); Category: Capacitors
MN17 MN18 = Inductor_0603: Manufacturer: TDK Corporation; Manufacturer Part Number: GLFR1608T101M-LR; Part Description: 100µH Shielded Wirewound Inductor 80mA 5.5 Ohm 0603 (1608 Metric); Tolerance: ±20%; Shielding: Shielded; DC Resistance (DCR): 5.5 Ohm; Value: 100uH; Supplier 1: Digi-Key; Supplier Part Number 1: 445-6150-6-ND; RoHS: RoHS Compliant; Category: Inductors, Coils, Chokes; Stock 1: 127797; Pricing 1: 1=0.27, 10=0.244, 100=0.1676, 500=0.14324, 1000=0.10971 (USD); Packaging: Digi-Reel®; Part Status: Active; Type: Wirewound; Material - Core: -; Q @ Freq: -; Ratings: -; Operating Temperature: -40°C ~ 105°C; Mounting Type: Surface Mount; Package / Case: 0603 (1608 Metric); Supplier Device Package: 0603 (1608 Metric); Size / Dimension: 0.063" L x 0.031" W (1.60mm x 0.80mm); Height - Seated (Max): 0.039" (1.00mm); ComponentLink1URL: https://media.digikey.com/pdf/Data%20Sheets/TDK%20PDFs/GLFR%20Series.pdf; ComponentLink1Description: https://media.digikey.com/pdf/Data%20Sheets/TDK%20PDFs/GLFR%20Series.pdf; Manufacturer Part Number 1: GLFR1608T101M-LR
MN19 MN20 = Inductor_0603: Part Description: 100µH Shielded Wirewound Inductor 80mA 5.5 Ohm 0603 (1608 Metric); Manufacturer: TDK Corporation; Manufacturer Part Number: GLFR1608T101M-LR; DC Resistance (DCR): 5.5 Ohm; Shielding: Shielded; Tolerance: ±20%; Value: 100uH; Category: Inductors, Coils, Chokes; ComponentLink1Description: https://media.digikey.com/pdf/Data%20Sheets/TDK%20PDFs/GLFR%20Series.pdf; ComponentLink1URL: https://media.digikey.com/pdf/Data%20Sheets/TDK%20PDFs/GLFR%20Series.pdf; Height - Seated (Max): 0.039" (1.00mm); Material - Core: -; Mounting Type: Surface Mount; Operating Temperature: -40°C ~ 105°C; Package / Case: 0603 (1608 Metric); Packaging: Digi-Reel®; Part Status: Active; Pricing 1: 1=0.27, 10=0.244, 100=0.1676, 500=0.14324, 1000=0.10971 (USD); Q @ Freq: -; Ratings: -; RoHS: RoHS Compliant; Size / Dimension: 0.063" L x 0.031" W (1.60mm x 0.80mm); Stock 1: 127797; Supplier 1: Digi-Key; Supplier Device Package: 0603 (1608 Metric); Supplier Part Number 1: 445-6150-6-ND; Type: Wirewound; Manufacturer Part Number 1: GLFR1608T101M-LR
MN21-MN24 = Inductor_0603: Manufacturer: COILCRAFT; Part Description: INDUCTOR, RF, 47NH, 5%, 2.4GHZ, SMD; Product Range:0402HP Series; Inductance:47nH; Inductance Tolerance:± 5%; High Frequency Inductor Case:0402 [1005 Metric]; Self Resonant Frequency Min:2.4GHz; DC Resistance Max:0.58ohm; DC Current Rating:420mA; Manufacturer Part Number 1: 0402HP-47NXJLU; SVHC: No SVHC (15-Jun-2015); Inductance Tolerance: ± 5%; High Frequency Inductor Case: 0402 [1005 Metric]; Inductance: 47; DC Resistance Max: 0.58; Self Resonant Frequency Min: 2.4; Product Range: 0402; DC Current Rating: 420; Inductor Construction: Wirewound; Supplier 1: Farnell; Supplier Part Number 1: 2285856; Packaging: Cut Tape; Inductor Case Style: 0402 [1005 Metric]; RoHS: Y-EX; value: 47nH
MN25 MN26 MN31 MN32 = Cap_0402: Manufacturer: Murata Electronics; Manufacturer Part Number 1: GRM155R71C104KA88D; Part Description: 0.10µF ±10% 16V X7R Ceramic Capacitor -55°C ~ 125°C Surface Mount, MLCC 0402 (1005 Metric) 0.039" L x 0.020" W (1.00mm x 0.50mm); Tolerance: 10 %; Capacitance: 0.1 uF; Case Length: 1 mm; Dielectric: X7R; Case Height: 0.5 mm; Temperature Coefficient / Code: +/- 15 %; Value: 100nF, 16V; Supplier 1: Mouser; Supplier Part Number 1: 81-GRM155R71C104KA88; Case Code - in: 0402; RoHS: RoHS Compliant; Operating Temperature Range: - 55 C to + 125 C; Series: GRM; Termination Style: SMD/SMT; Package / Case: 0402 (1005 metric); Voltage Rating DC: 16 V; Type: General Purpose MLCC; Maximum Operating Temperature: + 125 C; Case Code - mm: 1005; Minimum Operating Temperature: - 55 C; Product Category: Low & Medium Capacitance SMD Ceramic Chip Capacitors; Packaging: Reel; Product: General Type MLCCs; Category: Multilayer Ceramic Capacitors MLCC - SMD/SMT; Brand: Murata Electronics; Case Width: 0.5 mm; RoHS - Mouser: Y; Standard Pack Qty: 10000; Minimum Order Quantity: 1; Reeling: True
MN28 MN30 MN41 MN42 MN47 MN48 = Cap_0402: Manufacturer Part Number: 04025U2R0BAT2A; Manufacturer: AVX; Part Description: 2pF ±0.1pF 50V C0G, NP0 Ceramic Capacitor -55°C ~ 125°C Surface Mount, MLCC 0402 (1005 Metric) 0.039" L x 0.020" W (1.00mm x 0.50mm); Product Range: U Series; Voltage Rating: 50; SVHC: No SVHC (17-Dec-2014); Capacitance Tolerance: ± 0.1; Ceramic Capacitor Case: 0402 [1005 Metric]; Capacitance: 2; Dielectric Characteristic: C0G / NP0; Value: 2pF; Supplier 1: Farnell; Supplier Part Number 1: 2332536; Operating Temperature Max: 125; RoHS: YES; Operating Temperature Min: -55; Capacitance Tolerance ±: ± 0.1; Packaging: Cut Tape; MSL: MSL 1 - Unlimited; Manufacturer Part Number 1: 04025U2R0BAT2A
MN33 MN34 MN39 MN40 = Cap_0402: Manufacturer: Murata Electronics North America; Part Description: 510pF ±5% 50V C0G, NP0 Ceramic Capacitor -55°C ~ 125°C Surface Mount, MLCC 0402 (1005 Metric) 0.039" L x 0.020" W (1.00mm x 0.50mm); Manufacturer Part Number 1: GRM1555C1H511JA01D; Voltage - Rated: 50V; Temperature Coefficient: C0G, NP0; Tolerance: ±5%; Value: 510pF; Supplier 1: Digi-Key; Supplier Part Number 1: 490-3237-1-ND; Height - Seated (Max): -; Features: -; Size / Dimension: 0.039" L x 0.020" W (1.00mm x 0.50mm); Applications: General Purpose; Lead Spacing: -; Package / Case: 0402 (1005 Metric); Ratings: -; Thickness (Max): 0.022" (0.55mm); Lead Style: -; Operating Temperature: -55°C ~ 125°C; Mounting Type: Surface Mount, MLCC; Capacitance: 510pF; Category: Capacitors; RoHS: RoHS Compliant; Packaging: Cut Tape (CT)
MN36 MN38 = Cap_0402: Manufacturer: Murata Electronics North America; Manufacturer Part Number 1: GRM1555C1H1R2CA01D; Part Description: '1.2pF ±0.25pF 50V C0G, NP0 Ceramic Capacitor -55°C ~ 125°C Surface Mount, MLCC 0402 (1005 Metric) 0.039" L x 0.020" W (1.00mm x 0.50mm); Temperature Coefficient: C0G, NP0; Voltage - Rated: 50V; Tolerance: ±0.25pF; Value: 1.2pF; Supplier 1: Digi-Key; Supplier Part Number 1: 490-5927-1-ND; Lead Style: -; Category: Capacitors; Features: -; Packaging: Cut Tape (CT); Operating Temperature: -55°C ~ 125°C; Package / Case: 0402 (1005 Metric); Applications: General Purpose; Size / Dimension: 0.039" L x 0.020" W (1.00mm x 0.50mm); Lead Spacing: -; Ratings: -; Mounting Type: Surface Mount, MLCC; RoHS: RoHS Compliant; Height - Seated (Max): -; Thickness (Max): 0.022" (0.55mm); Capacitance: 1.2pF
T1 T2 T7 T8 = Balun_v2: Manufacturer: Mini-circuits; Part Description: BALUN WIDE BAND; Manufacturer Part Number 1: TCM1-63AX+; Supplier 1: Mini-circuits; Supplier Part Number 1: TCM1-63AX+
T3-T6 = TC1-1-13M+: Part Description: RF balun; 1:1 ratio; 3 dB bandwidth: 0.3 MHz to 3.5 GHz; 3.8mm x 3.8mm; Manufacturer: Minicircuits; Supplier 1: Minicircuits; Manufacturer Part Number 1: TC1-1-13M-45+; Supplier Part Number 1: TC1-1-13M-45+